# EAGLE schematic AmpBoardSchematic (EAGLE 8.3.2)
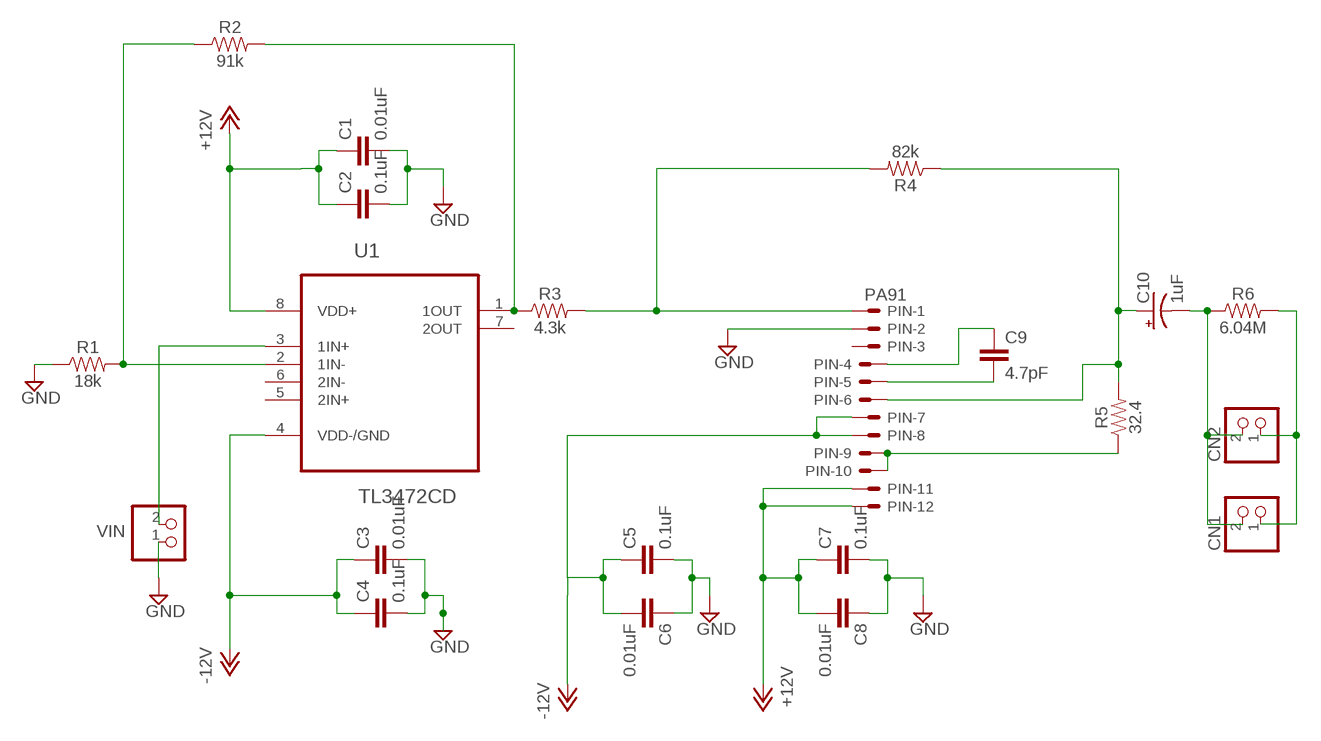
[diagram p0: schematic, sheet 1]

## Parts
C1  0.01uF  CAPACITOR_0805_M  [RESC0805_M]
C2  0.1uF  CAPACITOR_0805_M  [RESC0805_M]
C3  0.01uF  CAPACITOR_0805_M  [RESC0805_M]
C4  0.1uF  CAPACITOR_0805_M  [RESC0805_M]
C5  0.1uF  CAPACITOR_0805_M  [RESC0805_M]
C6  0.01uF  CAPACITOR_0805_M  [RESC0805_M]
C7  0.1uF  CAPACITOR_0805_M  [RESC0805_M]
C8  0.01uF  CAPACITOR_0805_M  [RESC0805_M]
C9  4.7pF  CAPACITOR_0805_M  [RESC0805_M]
C10  1uF  CPOL-US085CS-1AR  [085CS_1AR]
CN1  JST_2PIN-THM  [JST-PH-2-THM]
CN2  JST_2PIN-THM  [JST-PH-2-THM]
PIN  PA91  22-23-2121  [22-23-2121]
R1  18k  RESISTOR0805  [0805]
R2  91k  RESISTOR0805  [0805]
R3  4.3k  RESISTOR0805  [0805]
R4  82k  RESISTOR0805  [0805]
R5  32.4  RESISTOR0805  [0805]
R6  6.04M  RESISTOR0805  [0805]
U1  TL3472CD  [SOIC127P600X175-8N]
VIN  JST_2PIN-THM  [JST-PH-2-THM]

## Nets
+12V: C1.1 C2.1 C7.1 C8.2 PIN.11 PIN.12 U1.8(VDD+)
-12V: C3.1 C4.1 C5.1 C6.2 PIN.7 PIN.8 U1.4(VDD-/GND)
GND: C1.2 C2.2 C3.2 C4.2 C5.2 C6.1 C7.2 C8.1 PIN.2 R1.1 VIN.1
N$1: R1.2 R2.1 U1.2(1IN-)
N$2: R2.2 R3.1 U1.1(1OUT)
N$3: PIN.1 R3.2 R4.2
N$4: PIN.9 PIN.10 R5.1
N$5: C10.+ PIN.6 R4.1 R5.2
N$6: C9.1 PIN.4
N$7: C9.2 PIN.5
N$8: C10.- CN1.2 CN2.2 R6.1
N$9: CN1.1 CN2.1 R6.2
VIN: U1.3(1IN+) VIN.2
Unconnected: PIN.3 U1.5(2IN+) U1.6(2IN-) U1.7(2OUT)

## Library data of the parts
C1 C3 C6 C8 = Nordic_nRF:CAPACITOR: Generic chip capacitor; MF: KEMET; MPN: C0805C103K1RACTU; OC_FARNELL: 1414661
C2 C4 C5 C7 = Nordic_nRF:CAPACITOR: Generic chip capacitor; MF: AVX; MPN: 08055C104KAT2A; OC_FARNELL: 499687
C9 = Nordic_nRF:CAPACITOR: Generic chip capacitor; MF: KEMET; MPN: C0805C479C5GACTU; OC_FARNELL: 1800809
C10 = resistor:CPOL-US: POLARIZED CAPACITOR, American symbol; MF: AVX; MPN: 06035A102JAT2A; OC_FARNELL: 317202
CN1 CN2 VIN = adafruit:JST_2PIN: JST 2-Pin Connectors of various flavors SMT-RA (S2B-PH-SM4) 4UConnector #17311 SMT (B2B-PH-SM4) THM-RA (S2B-PH) THM (B2B-PH); OC_FARNELL: unknown
PIN = con-molex:22-23-2121: .100" (2.54mm) Center Header - 12 Pin; OC_FARNELL: unknown; OC_NEWARK: 56H0456
R1 = SparkFun-Resistors:RESISTOR: Generic Resistor Package; MF: WELWYN; MPN: WCR0805-18KFI; OC_FARNELL: 1100322
R2 = SparkFun-Resistors:RESISTOR: Generic Resistor Package; MF: KOA SPEAR ELECTRONICS; MPN: SG73S2ATTD9102F; OC_FARNELL: 1400374
R3 = SparkFun-Resistors:RESISTOR: Generic Resistor Package; MF: VISHAY; MPN: CRCW08054K30FKEA; OC_FARNELL: 1152372
R4 = SparkFun-Resistors:RESISTOR: Generic Resistor Package; MF: WELWYN; MPN: WCR0805-82KFI; OC_FARNELL: 1100327
R5 = SparkFun-Resistors:RESISTOR: Generic Resistor Package; MF: TE CONNECTIVITY; MPN: RN73C2A32K4BTDF; OC_FARNELL: 1140967
R6 = SparkFun-Resistors:RESISTOR: Generic Resistor Package; MF: VISHAY; MPN: CRCW08056M04FKEA.; OC_FARNELL: 2123607
U1 = TL3472CD:TL3472CD: HIGH-SLEW-RATE, SINGLE-SUPPLY OPERATIONAL AMPLIFIER; AVAILABILITY: Good; DESCRIPTION: High-Slew- ate, Single-Supply Operational Amplifier 8-SOIC 0 to 70; MF: Texas Instruments; MP: TL3472CD; OC_FARNELL: unknown; PACKAGE: SOIC-8 Texas Instruments; PRICE: 0.47 USD